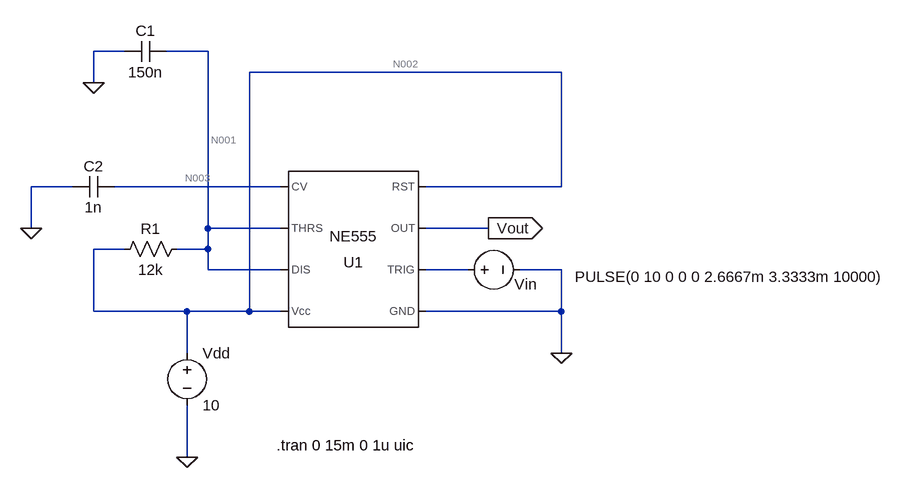
[diagram p0: schematic Draft2.asc]
Draft2.asc, the LTspice schematic file:
Version 4
SHEET 1 968 680
WIRE -224 -192 -272 -192
WIRE -96 -192 -160 -192
WIRE 448 -160 -32 -160
WIRE -272 -144 -272 -192
WIRE -304 16 -368 16
WIRE 16 16 -240 16
WIRE 448 16 448 -160
WIRE 448 16 240 16
WIRE -368 80 -368 16
WIRE -96 80 -96 -192
WIRE 16 80 -96 80
WIRE 336 80 240 80
WIRE -224 112 -272 112
WIRE -96 112 -96 80
WIRE -96 112 -144 112
WIRE -96 144 -96 112
WIRE 16 144 -96 144
WIRE 304 144 240 144
WIRE 448 144 384 144
WIRE -272 208 -272 112
WIRE -128 208 -272 208
WIRE -32 208 -32 -160
WIRE -32 208 -128 208
WIRE 16 208 -32 208
WIRE 448 208 448 144
WIRE 448 208 240 208
WIRE -128 272 -128 208
WIRE 448 272 448 208
WIRE -128 432 -128 352
FLAG 448 272 0
FLAG 336 80 Vout
IOPIN 336 80 Out
FLAG -368 80 0
FLAG -128 432 0
FLAG -272 -144 0
SYMBOL Misc\\NE555 128 112 R180
SYMATTR InstName U1
SYMBOL voltage 288 144 R270
WINDOW 0 -38 105 VTop 2
WINDOW 3 5 421 VBottom 2
WINDOW 123 0 0 Left 0
WINDOW 39 0 0 Left 0
SYMATTR InstName Vin
SYMATTR Value PULSE(0 10 0 0 0 2.6667m 3.3333m 10000)
SYMBOL cap -240 0 R90
WINDOW 0 0 32 VBottom 2
WINDOW 3 32 32 VTop 2
SYMATTR InstName C2
SYMATTR Value 1n
SYMBOL res -128 96 R90
WINDOW 0 0 56 VBottom 2
WINDOW 3 32 56 VTop 2
SYMATTR InstName R1
SYMATTR Value 12k
SYMBOL voltage -128 256 R0
WINDOW 123 0 0 Left 0
WINDOW 39 0 0 Left 0
SYMATTR InstName Vdd
SYMATTR Value 10
SYMBOL cap -160 -208 R90
WINDOW 0 0 32 VBottom 2
WINDOW 3 32 32 VTop 2
SYMATTR InstName C1
SYMATTR Value 150n
TEXT 10 414 Left 2 !.tran 0 15m 0 1u uic

The netlist it stands for:
* Draft2.asc
XU1 0 N004 Vout N002 N003 N001 N001 N002 NE555  ; pins GND TRIG OUT RST CV THRS DIS Vcc
Vin N004 0 PULSE(0 10 0 0 0 2.6667m 3.3333m 10000)
C2 N003 0 1n
R1 N001 N002 12k
Vdd N002 0 10
C1 N001 0 150n
.tran 0 15m 0 1u uic
.lib NE555.sub
.backanno
.end

* Results of the author's LTspice run, read from the files saved beside the schematic
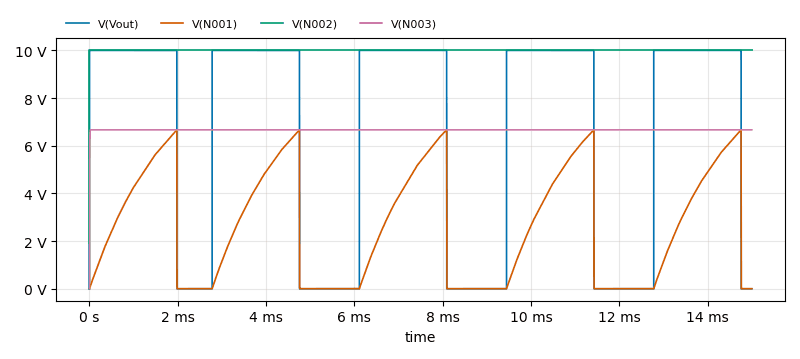
[diagram p1: Transient Analysis of Draft2.asc, plotted from the saved traces]
* Transient Analysis, 1 run:
*   V(Vout): min 0 V, max 10 V, average 6.591 V, rms 8.119 V, last 60 µV
*   V(N001): min 0 V, max 6.668 V, average 2.586 V, rms 3.553 V, last 4.998 mV
*   V(N002): min 0 V, max 10 V, average 10 V, rms 10 V, last 10 V
*   V(N003): min 0 V, max 6.667 V, average 6.665 V, rms 6.666 V, last 6.667 V